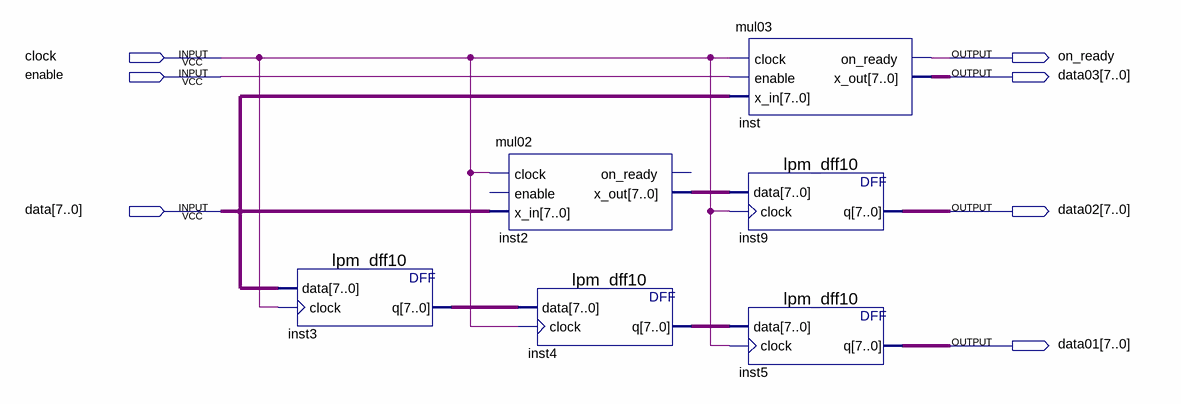
[diagram p0: schematic sheet]
// Quartus schematic mul010203.bdf as structural Verilog: 6 symbols, 7 pins
module mul010203 (
  input  clock,
  input  enable,
  input  [7:0] data,
  output on_ready,
  output [7:0] data03,
  output [7:0] data02,
  output [7:0] data01
);

  wire [7:0] inst2_x_out, inst3_q, inst4_q;

  lpm_dff10 inst3 (.data(data), .clock(clock), .q(inst3_q));
  mul02 inst2 (.clock(clock), .x_in(data), .x_out(inst2_x_out));  // open: enable, on_ready
  lpm_dff10 inst4 (.data(inst3_q), .clock(clock), .q(inst4_q));
  mul03 inst (.clock(clock), .enable(enable), .x_in(data), .on_ready(on_ready), .x_out(data03));
  lpm_dff10 inst9 (.data(inst2_x_out), .clock(clock), .q(data02));
  lpm_dff10 inst5 (.data(inst4_q), .clock(clock), .q(data01));
endmodule
